# EasyEDA Pro project New Project_2023-10-24_16-38-30.eprj

# Schematic Schematic1
Create Date: 2023-10-24; Page Name: P1; Project Name: New Project_2023-10-24_16-38-30; Schematic Name: Schematic1; Update Date: 2023-10-29; Company: 嘉立创EDA; Page Size: A4; Version: V1.0
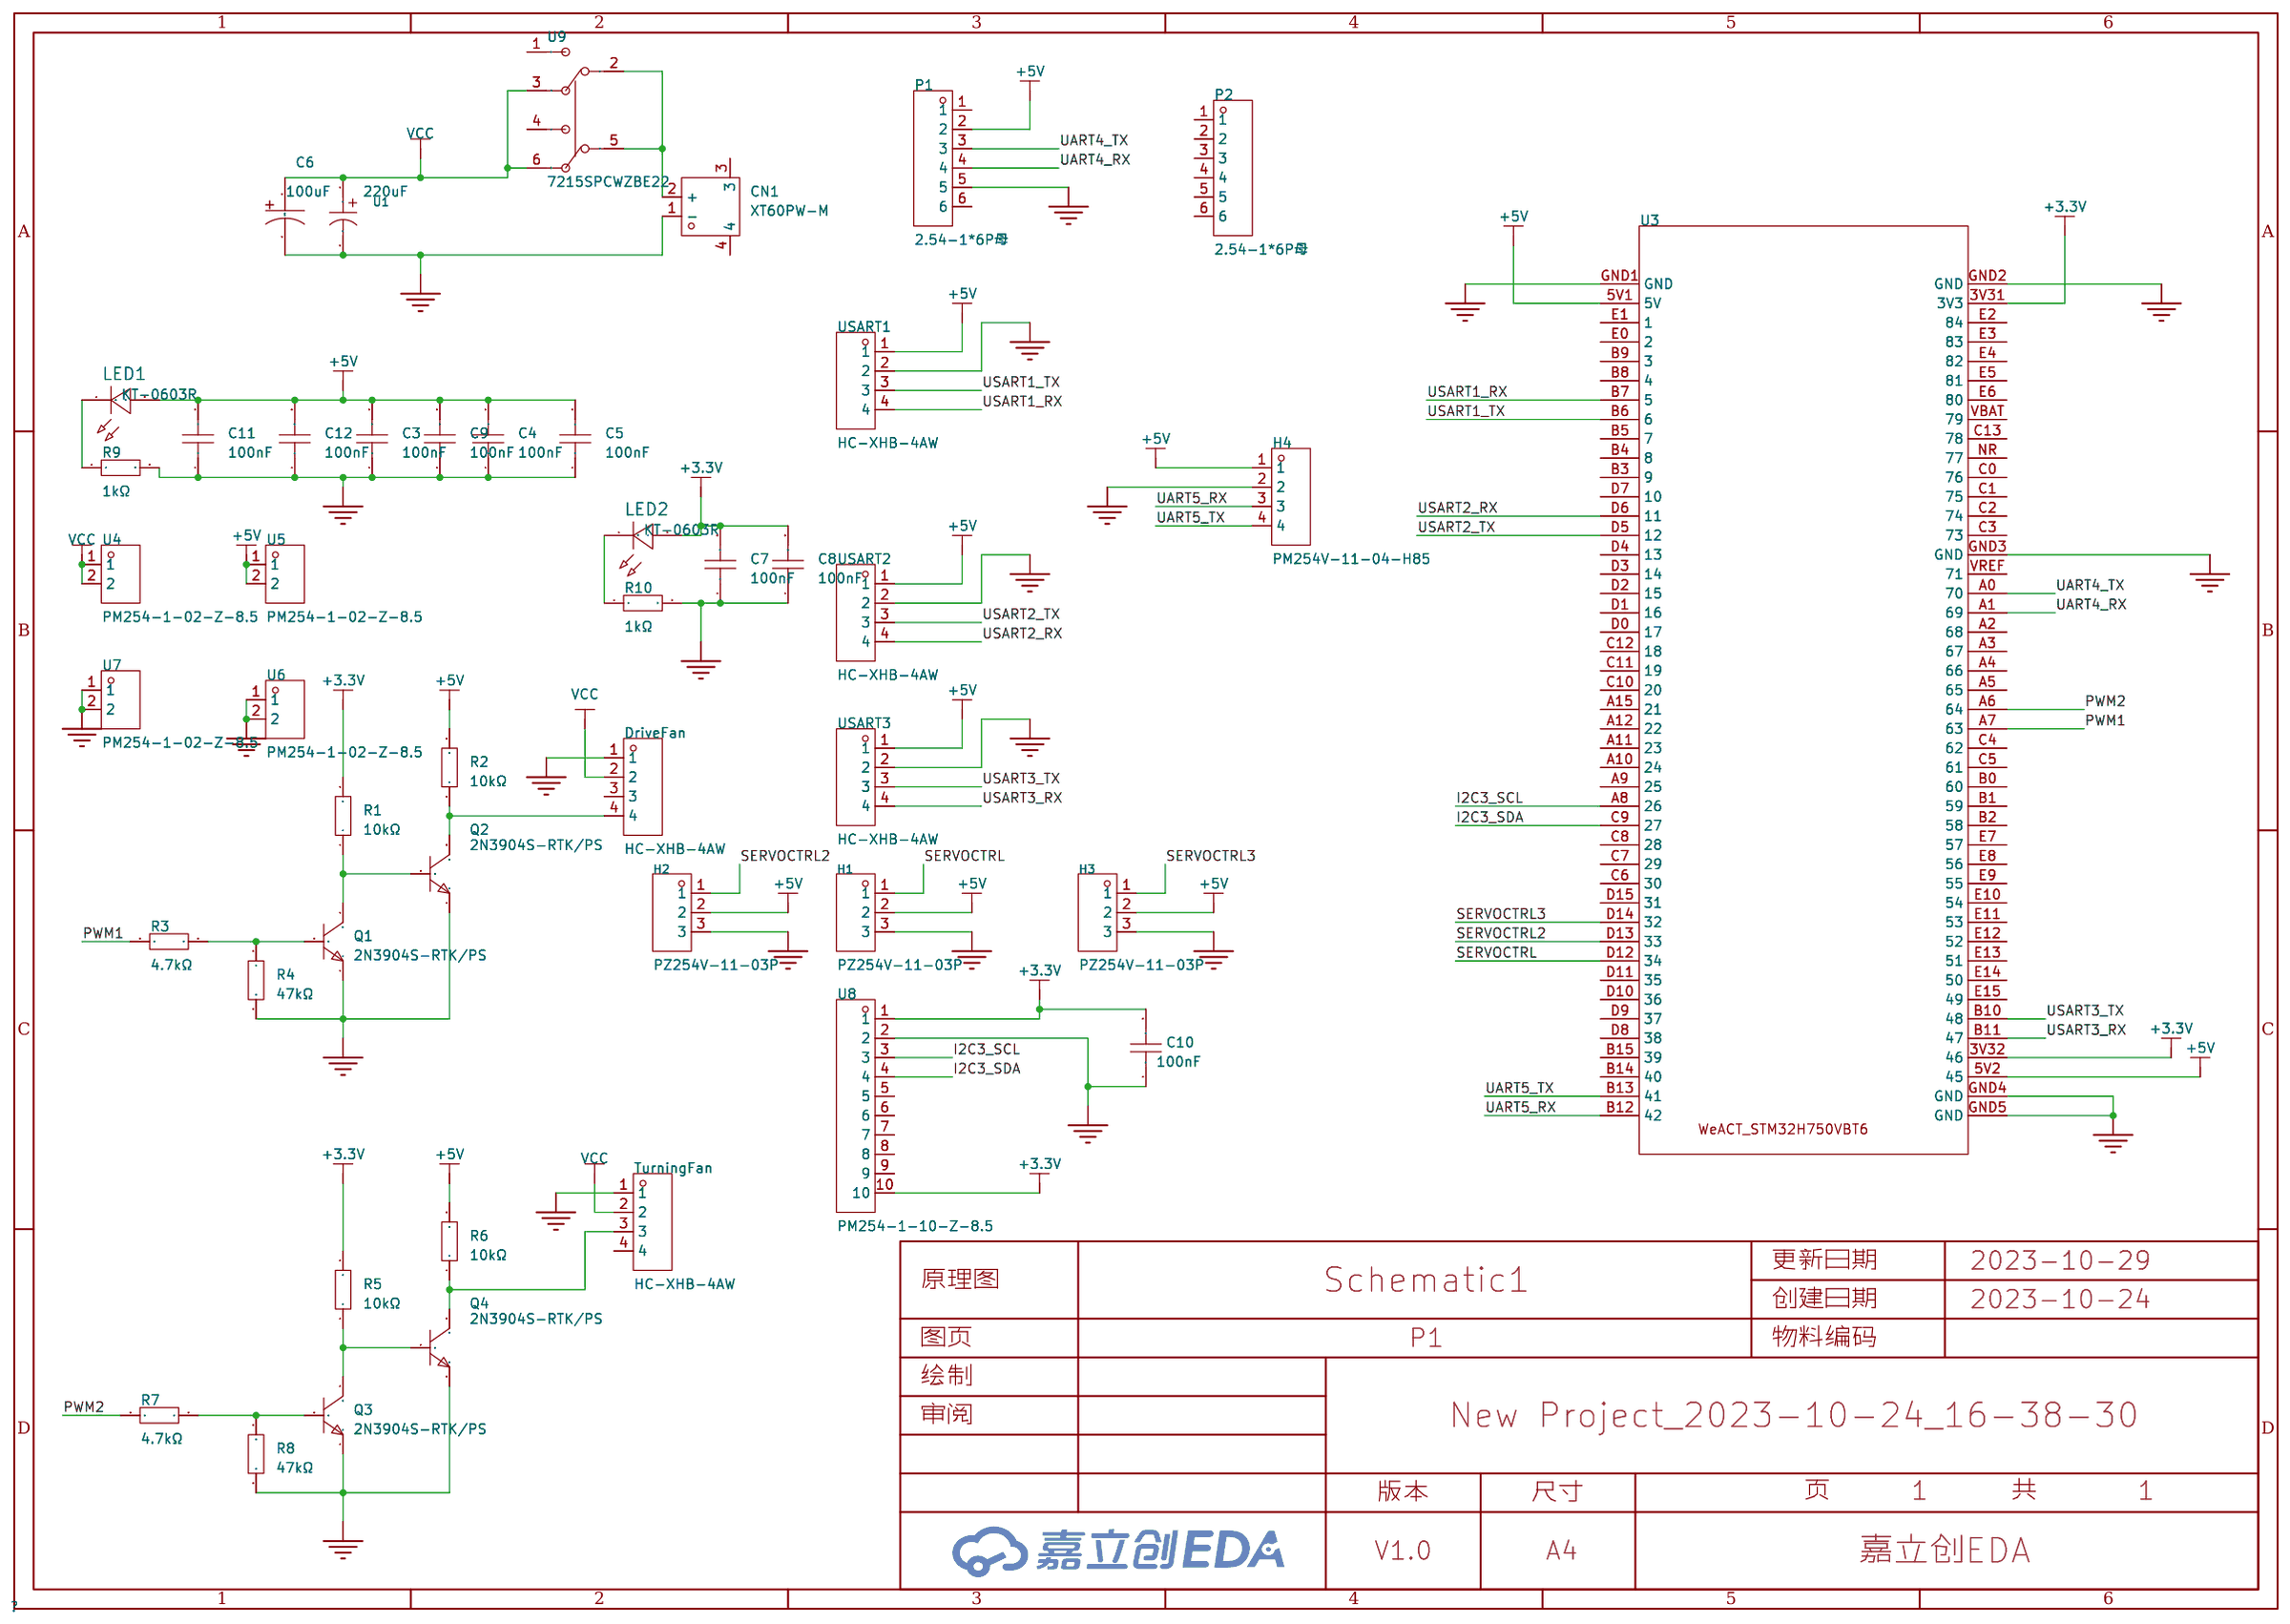
[diagram p0: schematic sheet]

## Parts
C3  100nF  [C0603]
C4  100nF  [C0603]
C5  100nF  [C0603]
C6  100uF  [CAP-SMD_BD6.3-L6.6-W6.6-RD]
C7  100nF  [C0603]
C8  100nF  [C0603]
C9  100nF  [C0603]
C10  100nF  [C0603]
C11  100nF  [C0603]
C12  100nF  [C0603]
CN1  XT60PW-M  [CONN-TH_XT60PW-M]
DriveFan  HC-XHB-4AW  [CONN-TH_4P-P2.5_HCTL_HC-XHB-4AW]
H1  PZ254V-11-03P  [HDR-TH_3P-P2.54-V-M]
H2  PZ254V-11-03P  [HDR-TH_3P-P2.54-V-M]
H3  PZ254V-11-03P  [HDR-TH_3P-P2.54-V-M]
H4  PM254V-11-04-H85  [HDR-TH_4P-P2.54-V-F]
LED1  KT-0603R  [LED0603-RD]
LED2  KT-0603R  [LED0603-RD]
P1  2.54-1*6P母  [HDR-TH_6P-P2.54-V-F]
P2  2.54-1*6P母  [HDR-TH_6P-P2.54-V-F]
Q1  2N3904S-RTK/PS  [SOT-23-3_L2.9-W1.3-P1.90-LS2.4-TR]
Q2  2N3904S-RTK/PS  [SOT-23-3_L2.9-W1.3-P1.90-LS2.4-TR]
Q3  2N3904S-RTK/PS  [SOT-23-3_L2.9-W1.3-P1.90-LS2.4-TR]
Q4  2N3904S-RTK/PS  [SOT-23-3_L2.9-W1.3-P1.90-LS2.4-TR]
R1  10kΩ  [R0603]
R2  10kΩ  [R0603]
R3  4.7kΩ  [R0603]
R4  47kΩ  [R0603]
R5  10kΩ  [R0603]
R6  10kΩ  [R0603]
R7  4.7kΩ  [R0603]
R8  47kΩ  [R0603]
R9  1kΩ  [R0603]
R10  1kΩ  [R0603]
TurningFan  HC-XHB-4AW  [CONN-TH_4P-P2.5_HCTL_HC-XHB-4AW]
U1  220uF  [CAP-SMD_BD6.3-L6.6-W6.6-LS7.2-FD]
U3  -  [WeAct_STM32H750VBT6核心板]
U4  PM254-1-02-Z-8.5  [HDR-TH_2P-P2.54-V-F]
U5  PM254-1-02-Z-8.5  [HDR-TH_2P-P2.54-V-F]
U6  PM254-1-02-Z-8.5  [HDR-TH_2P-P2.54-V-F]
U7  PM254-1-02-Z-8.5  [HDR-TH_2P-P2.54-V-F]
U8  PM254-1-10-Z-8.5  [HDR-TH_10P-P2.54-V-F]
U9  7215SPCWZBE22  [SW-TH_6P-L12.7-W11.4-P4.70-LS4.8]
USART1  HC-XHB-4AW  [CONN-TH_4P-P2.5_HCTL_HC-XHB-4AW]
USART2  HC-XHB-4AW  [CONN-TH_4P-P2.5_HCTL_HC-XHB-4AW]
USART3  HC-XHB-4AW  [CONN-TH_4P-P2.5_HCTL_HC-XHB-4AW]

## Library data of the parts
C3-C5 C7-C12 = CC0603KRX7R9BB104: 容值:100nF;精度:±10%;额定电压:50V;材质(温度系数):X7R;; LCSC Part Name: 100nF ±10% 50V; Supplier Part: C14663; Manufacturer: YAGEO(国巨); Supplier Footprint: 0603; JLCPCB Part Class: 基础库; Datasheet: https://atta.szlcsc.com/upload/public/pdf/source/20180910/C282072_33301C7F631E79921B82A8DAC6BCC5B3.pdf; Supplier: LCSC; Tolerance: ±10%; Voltage Rated: 50V; Temperature Coefficient: X7R
C6 = VZH101M1ETR-0607: 容值:100uF;精度:±20%;额定电压:25V;纹波电流:-;等效串联电阻:-;; LCSC Part Name: 100uF ±20% 25V; Supplier Part: C311617; Manufacturer: lelon(立隆); Supplier Footprint: SMD,D6.3xL7.7mm; JLCPCB Part Class: Extended Part; Datasheet: https://atta.szlcsc.com/upload/public/pdf/source/20180930/C311617_94F1283F4013E6085CC80C8D936B2FD6.pdf; Supplier: LCSC; Tolerance: ±20%; Rated Voltage: 25V; φD: 6.3mm; L: 7.7mm; Lifetime @ Temp: 2000hrs@105℃; Operating Temperature: -45℃~+105℃
CN1 = XT60PW-M: 模型锂电连接器; LCSC Part Name: AMASS(艾迈斯)航模插头xt90连接器150公母对接pw锂电池公头 板插卧式XT60PW-M; Supplier Part: C98732; Manufacturer: AMASS(艾迈斯); JLCPCB Part Class: Extended Part; Datasheet: https://atta.szlcsc.com/upload/public/pdf/source/20180125/C98732_15168617837851301983.pdf; Supplier: LCSC
DriveFan TurningFan USART1-USART3 = HC-XHB-4AW: 参考系列:-;间距:2.5mm;插针结构:1x4P;排数:1;每排PIN数:4;行距:-;公母:公型插针;安装方式:弯插;额定电流:3A;工作温度范围:-25℃~+85℃;; LCSC Part Name: 2.54带锁扣卧式插件 4P 针座连接器线对板/线对线连接器; Supplier Part: C2845507; Manufacturer: HCTL(华灿天禄); Supplier Footprint: 弯插,P=2.5mm; JLCPCB Part Class: 扩展库; Datasheet: https://atta.szlcsc.com/upload/public/pdf/source/20210729/C2845505_EFBF7AEAA36C6A5A1E79F7933436620E.pdf; Supplier: LCSC; Pitch: 2.5mm; Pins Structure: 1x4P; Number of Rows: 1; Number of PINs Per Row: 4; Gender: 公型插针; Mounting Style: 弯插; Current Rating (Max): 3A; Operating Temperature Range: -25℃~+85℃
H1-H3 = PZ254V-11-03P: 排数:单排;总PIN位数:3;间距:2.54mm;插针结构:1x3P;行距:-;安装类型:直插;圆针/方针:方针;额定电流:3A;额定电压:250V;配合针长度:6mm;塑高:2.5mm;端接针长度:3mm;工作温度范围:-40℃~+105℃;颜色:黑色;; LCSC Part Name: 2.54mm 1x3P 直插 方针; Supplier Part: C2937625; Manufacturer: XFCN(兴飞); Supplier Footprint: 直插,P=2.54mm; JLCPCB Part Class: 扩展库; Datasheet: 2022-07-12/581362A/62b9d00620994b3696be7eb4af85ad72/双排排针和单排排针.pdf; Supplier: LCSC; Number of Rows: 单排; Number of Pins: 3; Pitch: 2.54mm; Pin Structure: 1x3P; Mounting Type: 直插; Circluar Pins/Square Pins: 方针; Current Rating (Max): 3A; Voltage Rating (Max): 250V; Length of Mating Pin: 6mm; Insulation Height: 2.5mm; Length of End Connection Pin: 3mm; Operating Temperature Range: -40℃~+105℃; Color: 黑色
H4 = PM254V-11-04-H85: 排数:单排;总孔位数:4P;间距:2.54mm;插孔结构:1x4P;行距:-;安装类型:直插;塑高:-;触头材质:黄铜;触头镀层:-;; LCSC Part Name: 间距:2.54mm 1x4P 直插; Supplier Part: C541851; Manufacturer: XFCN(兴飞); Supplier Footprint: 插件,P=2.54mm; JLCPCB Part Class: 扩展库; Datasheet: https://atta.szlcsc.com/upload/public/pdf/source/20200518/C541849_85853D71FC67C51915A806977A588FDA.pdf; Supplier: LCSC; Number of Rows: 单排; Number of Holes: 4P; Pitch: 2.54mm; Holes Structure: 1x4P; Mounting Type: 直插; Contact Material: 黄铜
LED1 LED2 = KT-0603R: 发光颜色:红灯;二极管配置:-;透镜颜色:-;主波长:-;色温:-;功率:-;发光角度:-;安装方式:-;工作温度:-40℃~+85℃;; LCSC Part Name: 0603 红灯 高亮; Supplier Part: C2286; Manufacturer: KENTO; Supplier Footprint: 0603; JLCPCB Part Class: Basic Part; Datasheet: https://atta.szlcsc.com/upload/public/pdf/source/20160616/1466072038404.pdf; Supplier: LCSC; Emitted Color: 红灯; Operating Temperature: -40℃~+85℃
P1 P2 = 2.54-1*6P母: 排数:单排;总孔位数:6P;间距:2.54mm;插孔结构:1x6P;行距:-;安装类型:直插;塑高:-;触头材质:-;触头镀层:-;; LCSC Part Name: 间距:2.54mm 1x6P 直插; Supplier Part: C40877; Manufacturer: BOOMELE(博穆精密); Supplier Footprint: 插件,P=2.54mm; JLCPCB Part Class: 扩展库; Datasheet: https://atta.szlcsc.com/upload/public/pdf/source/20210301/C2718488_F4427B881E42CAA8DDB0B1C12B3A522C.pdf; Supplier: LCSC; Number of Rows: 单排; Number of Holes: 6P; Pitch: 2.54mm; Holes Structure: 1x6P; Mounting Type: 直插
Q1-Q4 = 2N3904S-RTK/PS: 晶体管类型:NPN;集射极击穿电压(Vceo):40V;集电极电流(Ic):200mA;功率(Pd):350mW;直流电流增益(hFE@Ic,Vce):100@10mA,1V;; LCSC Part Name: NPN 40V 200mA; Supplier Part: C18536; Manufacturer: KEC; Supplier Footprint: SOT-23; JLCPCB Part Class: 扩展库; Datasheet: https://atta.szlcsc.com/upload/public/pdf/source/20160416/1460799387204.pdf; Supplier: LCSC; Transistor Type: NPN; Collector-Emitter Breakdown Voltage (Vceo): 40V; Collector Current (Ic): 200mA; Power Dissipation (Pd): 350mW; Collector-Emitter Saturation Voltage (VCE(sat)@Ic,Ib): 300mV@50mA,5mA; DC Current Gain (hFE@Ic,Vce): 100@10mA,1V; Transition Frequency (fT): 300MHz; Operating Temperature: +150℃@(Tj)
R1 R2 R5 R6 = 0603WAF1002T5E: 电阻类型:厚膜电阻;阻值:10kΩ;精度:±1%;功率:100mW;; LCSC Part Name: 厚膜电阻 10kΩ ±1% 100mW; Supplier Part: C25804; Manufacturer: UNI-ROYAL(厚声); Supplier Footprint: 0603; JLCPCB Part Class: Basic Part; Datasheet: https://atta.szlcsc.com/upload/public/pdf/source/20200306/C422600_1E6D84923E4A46A82E41ADD87F860B5C.pdf; Supplier: LCSC; Type: 厚膜电阻; Tolerance: ±1%; Power(Watts): 100mW; Temperature Coefficient: ±100ppm/℃; Overload Voltage (Max): 75V; Operating Temperature Range: -55℃~+155℃
R3 R7 = 0603WAF4701T5E: 电阻类型:厚膜电阻;阻值:4.7kΩ;精度:±1%;功率:100mW;; LCSC Part Name: 4.7kΩ ±1% 100mW; Supplier Part: C23162; Manufacturer: UNI-ROYAL(厚声); Supplier Footprint: 0603; JLCPCB Part Class: Basic Part; Datasheet: https://atta.szlcsc.com/upload/public/pdf/source/20200306/C422600_1E6D84923E4A46A82E41ADD87F860B5C.pdf; Supplier: LCSC; Type: 厚膜电阻; Tolerance: ±1%; Power(Watts): 100mW; Temperature Coefficient: ±100ppm/℃; Overload Voltage (Max): 75V; Operating Temperature Range: -55℃~+155℃
R4 R8 = 0603WAF4702T5E: 电阻类型:厚膜电阻;阻值:47kΩ;精度:±1%;功率:100mW;; LCSC Part Name: 47kΩ ±1% 100mW; Supplier Part: C25819; Manufacturer: UNI-ROYAL(厚声); Supplier Footprint: 0603; JLCPCB Part Class: Basic Part; Datasheet: https://atta.szlcsc.com/upload/public/pdf/source/20200306/C422600_1E6D84923E4A46A82E41ADD87F860B5C.pdf; Supplier: LCSC; Type: 厚膜电阻; Tolerance: ±1%; Power(Watts): 100mW; Temperature Coefficient: ±100ppm/℃; Overload Voltage (Max): 75V; Operating Temperature Range: -55℃~+155℃
R9 R10 = 0603WAF1001T5E: 电阻类型:厚膜电阻;阻值:1kΩ;精度:±1%;功率:100mW;温度系数:±100ppm/℃;; LCSC Part Name: 厚膜电阻 1kΩ ±1% 100mW; Supplier Part: C21190; Manufacturer: UNI-ROYAL(厚声); Supplier Footprint: 0603; JLCPCB Part Class: Basic Part; Datasheet: https://atta.szlcsc.com/upload/public/pdf/source/20200306/C422600_1E6D84923E4A46A82E41ADD87F860B5C.pdf; Supplier: LCSC; Type: 厚膜电阻; Tolerance: ±1%; Power(Watts): 100mW; Temperature Coefficient: ±100ppm/℃; Overload Voltage (Max): 75V; Operating Temperature Range: -55℃~+155℃
U1 = RST220UF25V019: 容值:220uF;精度:±20%;额定电压:25V;纹波电流:165mA@120Hz;等效串联电阻:-;; LCSC Part Name: 220uF ±20% 25V; Supplier Part: C4747974; Manufacturer: KNSCHA(科尼盛); Supplier Footprint: SMD,D6.3xL7.7mm; JLCPCB Part Class: Extended Part; Datasheet: https://atta.szlcsc.com/upload/public/pdf/source/20220722/2E7F51AC9BE193B364DA1207D7353D66.pdf; Supplier: LCSC; Tolerance: ±20%; Rated Voltage: 25V; φD: 6.3mm; L: 7.7mm; Ripple Current: 165mA@120Hz; Lifetime @ Temp: 2000hrs@105℃; Operating Temperature: -55℃~+105℃
U3 = STM32H750VBT6: Check: false
U4-U7 = PM254-1-02-Z-8.5: 排数:单排;总孔位数:2P;间距:2.54mm;插孔结构:1x2P;行距:-;安装类型:直插;圆孔/方孔:方孔;额定电流:3A;额定电压:-;插孔方向:顶部;塑高:8.5mm;工作温度范围:-40℃~+105℃;; LCSC Part Name: 间距:2.54mm 1x2P 直插; Supplier Part: C2897365; Manufacturer: HCTL(华灿天禄); Supplier Footprint: 插件,P=2.54mm; JLCPCB Part Class: 扩展库; Datasheet: https://atta.szlcsc.com/upload/public/pdf/source/20230609/534BE42964C679BDE98E061007C4ABD6.pdf; Supplier: LCSC; Number of Rows: 单排; Number of Holes: 2P; Pitch: 2.54mm; Holes Structure: 1x2P; Mounting Type: 直插; Circular Hole / Square Hole: 方孔; Current Rating (Max): 3A; Holes Direction: 顶部; Insulation Height: 8.5mm; Operating Temperature Range: -40℃~+105℃
U8 = PM254-1-10-Z-8.5: 排数:单排;总孔位数:10P;间距:2.54mm;插孔结构:1x10P;行距:-;安装类型:直插;圆孔/方孔:方孔;额定电流:3A;额定电压:-;插孔方向:顶部;塑高:8.5mm;工作温度范围:-40℃~+105℃;; LCSC Part Name: 间距:2.54mm 1x10P 直插; Supplier Part: C2897373; Manufacturer: HCTL(华灿天禄); Supplier Footprint: 插件,P=2.54mm; JLCPCB Part Class: Extended Part; Datasheet: https://atta.szlcsc.com/upload/public/pdf/source/20230609/534BE42964C679BDE98E061007C4ABD6.pdf; Supplier: LCSC; Number of Rows: 单排; Number of Holes: 10P; Pitch: 2.54mm; Holes Structure: 1x10P; Mounting Type: 直插; Circular Hole / Square Hole: 方孔; Current Rating (Max): 3A; Holes Direction: 顶部; Insulation Height: 8.5mm; Operating Temperature Range: -40℃~+105℃
U9 = 7215SPCWZBE22: LCSC Part Name: 钮子开关; Supplier Part: C2895583; Manufacturer: C&amp;K; Supplier Footprint: 插件; JLCPCB Part Class: 扩展库; Datasheet: https://atta.szlcsc.com/upload/public/pdf/source/20211231/11C8489155551633DA4BD4318A5AC87F.pdf; Supplier: LCSC

## Nets
+3.3V: C7.2 C8.2 C10.2 LED2.2(A) R1.2 R5.2 U3.3V31(3V3) U3.3V32(46) U8.1 U8.10
+5V: C3.2 C4.2 C5.2 C9.2 C11.2 C12.2 H1.2 H2.2 H3.2 H4.1 LED1.2(A) P1.2 R2.2 R6.2 U3.5V1(5V) U3.5V2(45) U5.1 U5.2 USART1.1 USART2.1 USART3.1
GND: C3.1 C4.1 C5.1 C6.2 C7.1 C8.1 C9.1 C10.1 C11.1 C12.1 CN1.1(-) DriveFan.1 H1.3 H2.3 H3.3 H4.2 P1.5 Q1.1(E) Q2.1(E) Q3.1(E) Q4.1(E) R4.2 R8.2 R9.2 R10.2 TurningFan.1 U1.2 U3.GND1(GND) U3.GND2(GND) U3.GND3(GND) U3.GND4(GND) U3.GND5(GND) U6.1 U6.2 U7.1 U7.2 U8.2 USART1.2 USART2.2 USART3.2
VCC: C6.1 DriveFan.2 TurningFan.2 U1.1 U4.1 U4.2 U9.3 U9.6
I2C3_SCL: U3.A8(26) U8.3
I2C3_SDA: U3.C9(27) U8.4
PWM1: R3.2 U3.A7(63)
PWM2: R7.2 U3.A6(64)
SERVOCTRL: H1.1 U3.D12(34)
SERVOCTRL2: H2.1 U3.D13(33)
SERVOCTRL3: H3.1 U3.D14(32)
UART4_RX: P1.4 U3.A1(69)
UART4_TX: P1.3 U3.A0(70)
UART5_RX: H4.3 U3.B12(42)
UART5_TX: H4.4 U3.B13(41)
USART1_RX: U3.B7(5) USART1.4
USART1_TX: U3.B6(6) USART1.3
USART2_RX: U3.D6(11) USART2.4
USART2_TX: U3.D5(12) USART2.3
USART3_RX: U3.B11(47) USART3.4
USART3_TX: U3.B10(48) USART3.3
$1N689: Q1.2(B) R3.1 R4.1
$1N701: Q1.3(C) Q2.2(B) R1.1
$1N976: Q3.3(C) Q4.2(B) R5.1
$1N993: DriveFan.4 Q2.3(C) R2.1
$1N1002: Q4.3(C) R6.1 TurningFan.3
$1N1022: Q3.2(B) R7.1 R8.1
$1N3852: LED1.1(C) R9.1
$1N4179: LED2.1(C) R10.1
$1N8727: CN1.2(+) U9.2 U9.5

Not connected (* = marked no-connect by the designer): CN1 3 4; DriveFan 3; P1 1 6; P2 1 2 3 4 5 6; TurningFan 4; U3 A2(68) A3(67) A4(66) A5(65) A9(25) A10(24) A11(23) A12(22) A15(21) B0(60) B1(59) B2(58) B3(9) B4(8) B5(7) B8(4) B9(3) B14(40) B15(39) C0(76) C1(75) C2(74) C3(73) C4(62) C5(61) C6(30) C7(29) C8(28) C10(20) C11(19) C12(18) C13(78) D0(17) D1(16) D2(15) D3(14) D4(13) D7(10) D8(38) D9(37) D10(36) D11(35) D15(31) E0(2) E1(1) E2(84) E3(83) E4(82) E5(81) E6(80) E7(57) E8(56) E9(55) E10(54) E11(53) E12(52) E13(51) E14(50) E15(49) NR(77) VBAT(79) VREF(71); U8 5 6 7 8 9; U9 1 4

# Board PCB1
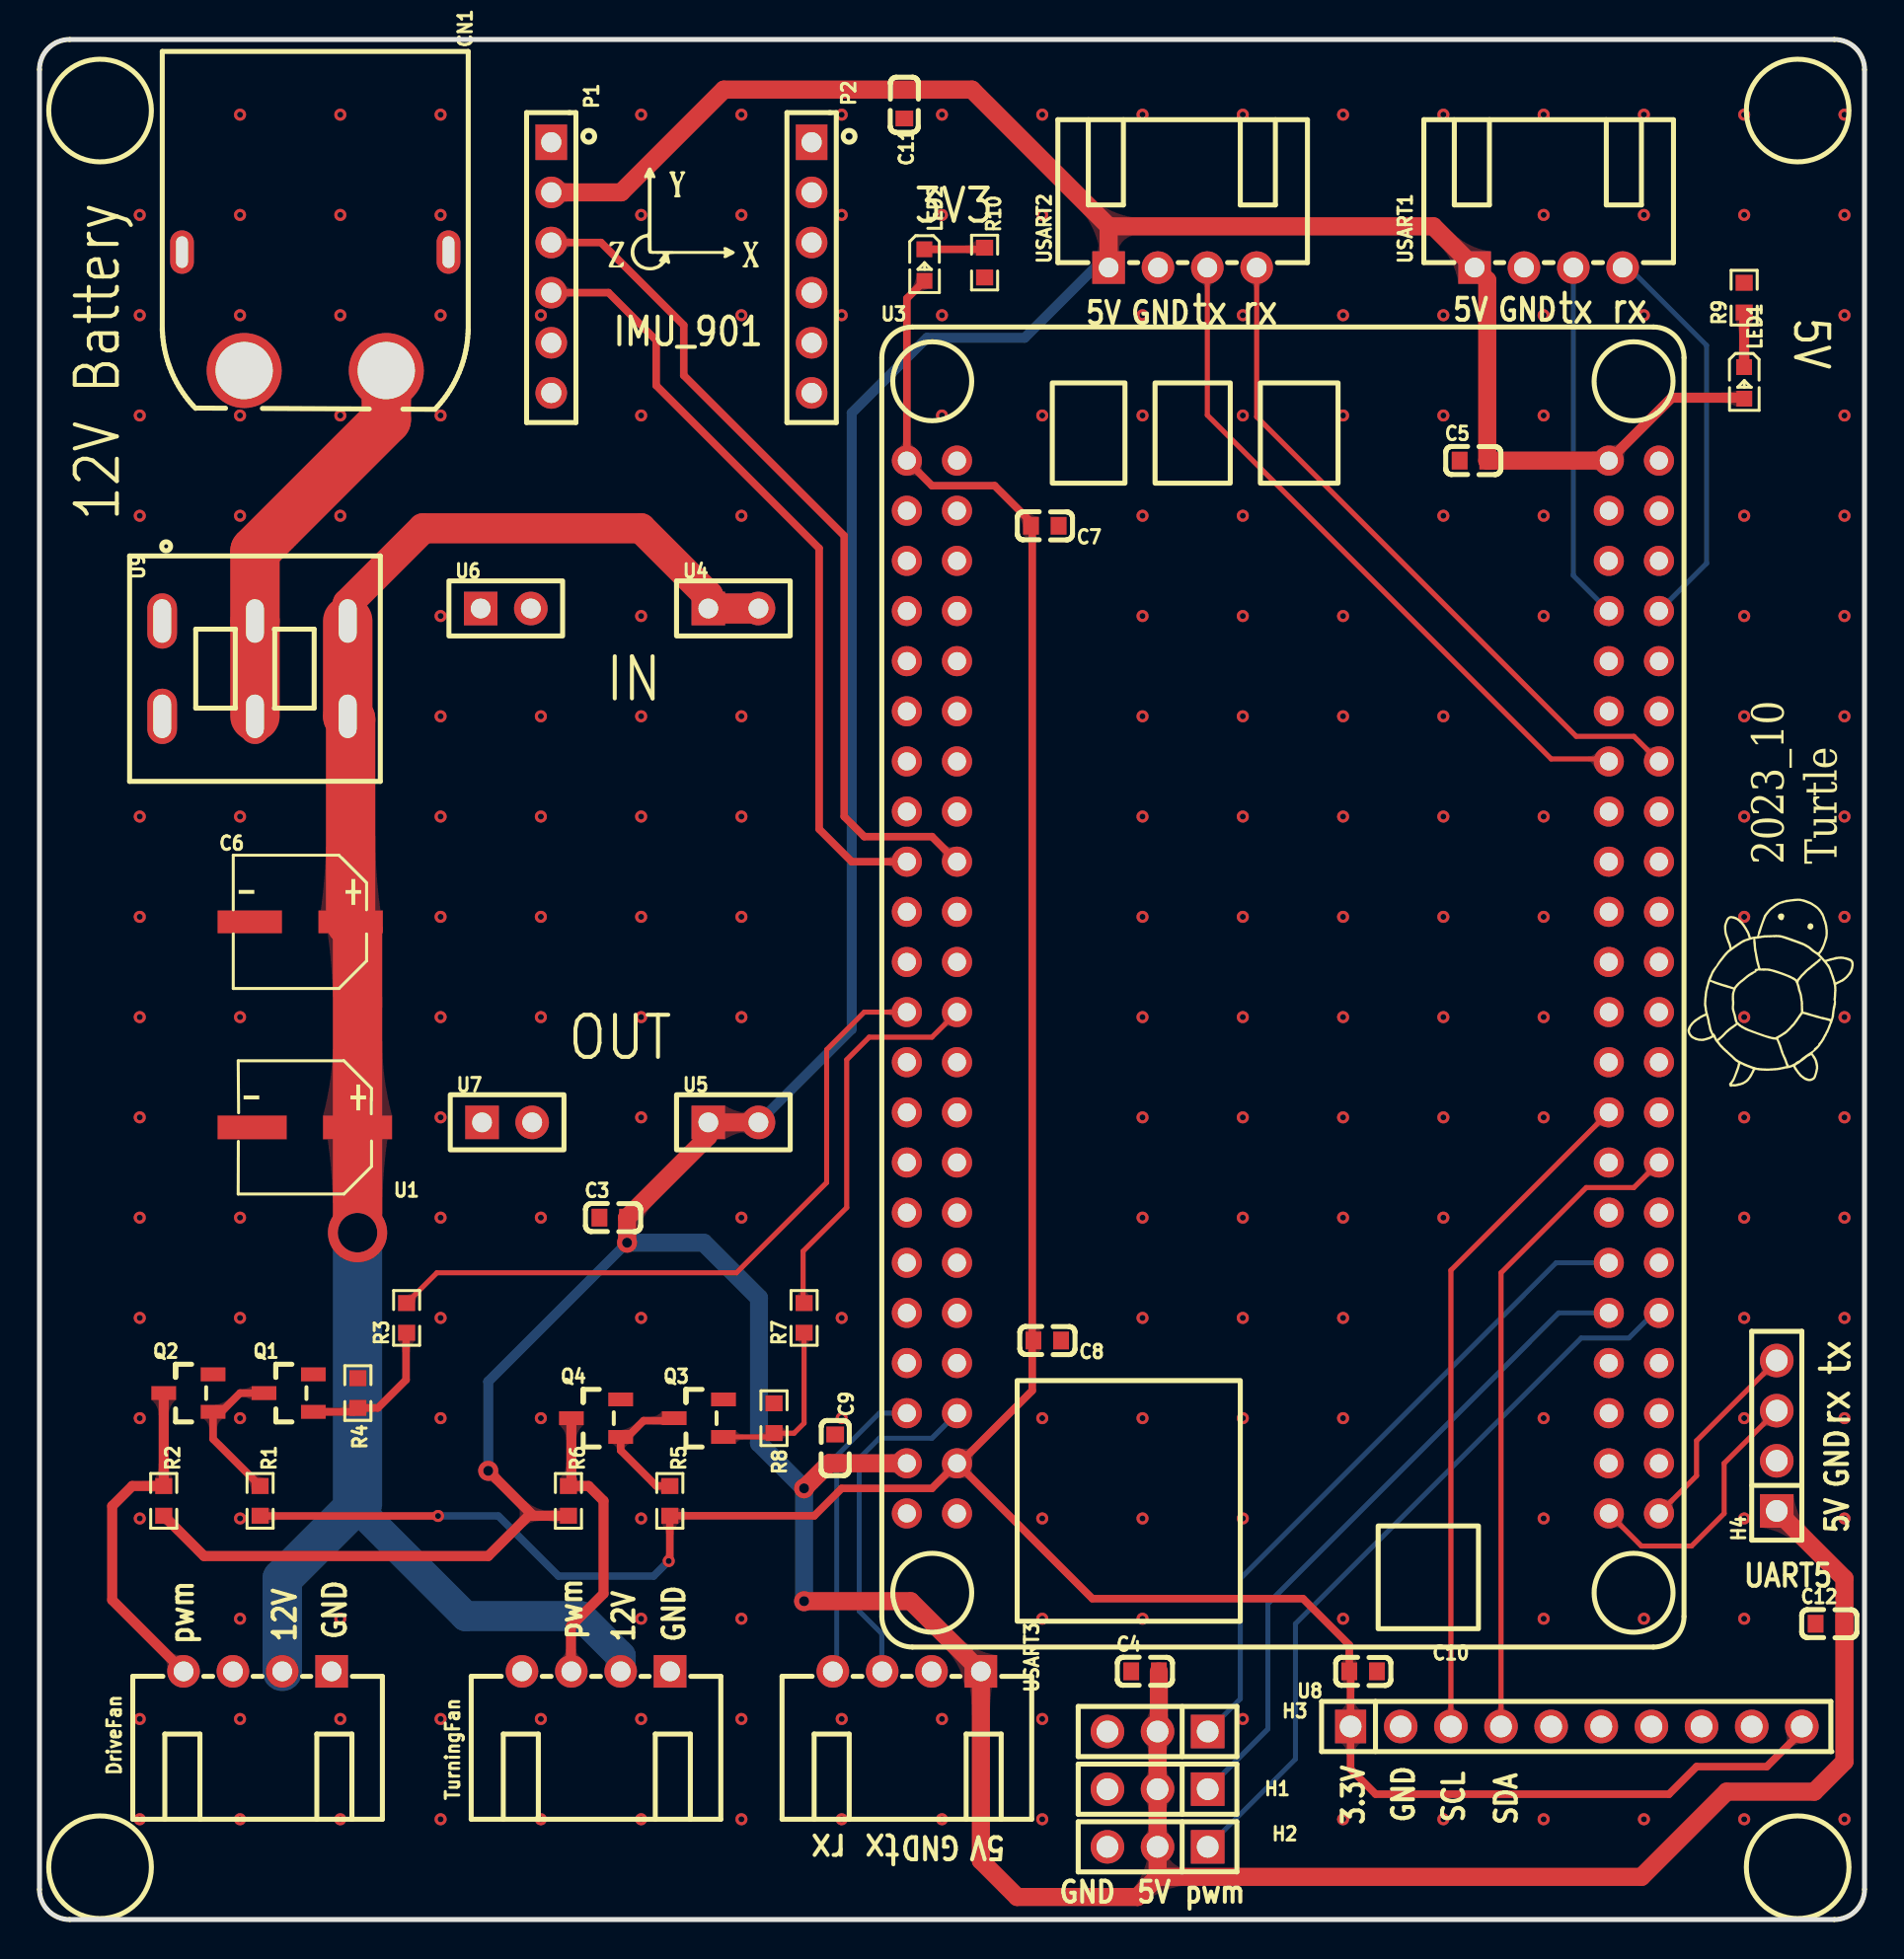
[diagram p1: board, top side]
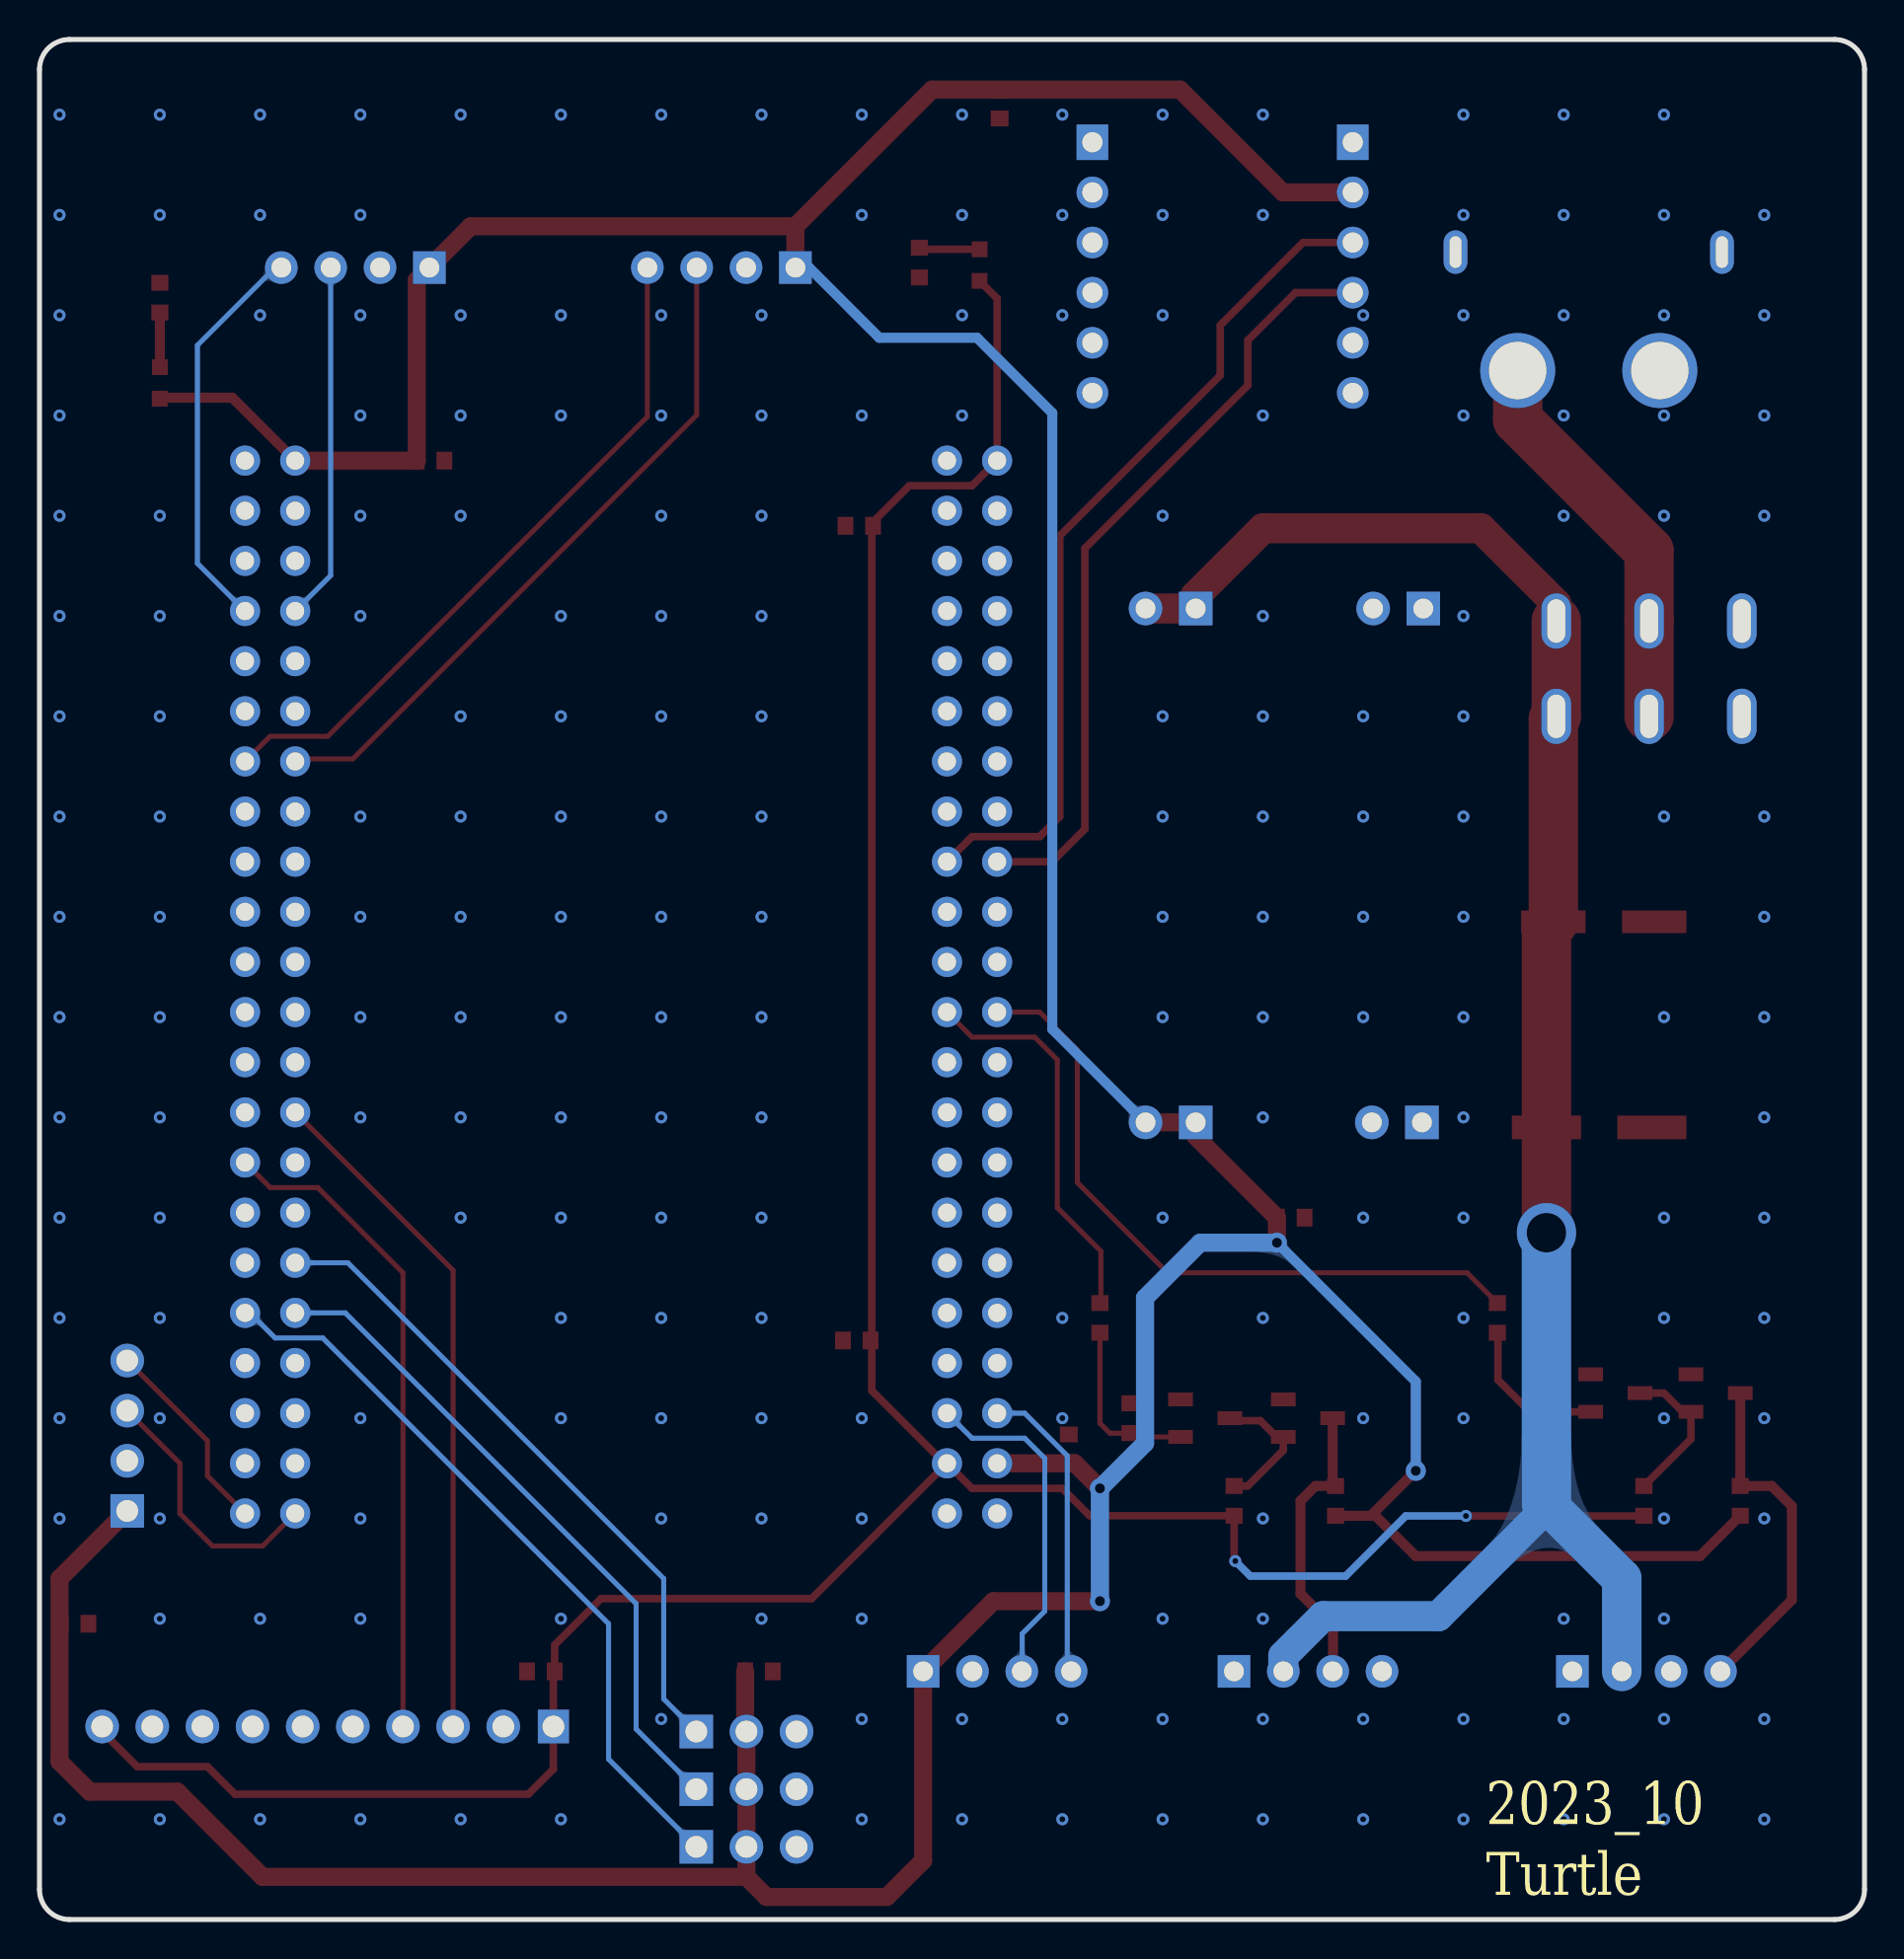
[diagram p2: board, bottom side, seen from below]

Outline 92.46 x 95.25 mm; copper layers: Top Layer, Bottom Layer. Coordinates in mm from the lower left corner of the outline.
Outline path: 0,93.73 0,1.52 arc(0.45,0.45) 1.52,0 90.93,0 arc(92.01,0.45) 92.46,1.52 92.46,93.73 arc(92.01,94.8) 90.93,95.25 1.52,95.25 arc(0.45,94.8) 0,93.73
Stack: Top Layer 0.035mm / Dielectric1 1.51mm FR4 er 4.5 / Bottom Layer 0.035mm

## Design rules (mm)
template: 自定义配置
spacing copperThickness1oz (default): track to track 0.102, other pairs 0.152 to 0.3
spacing copperThickness2oz: track to track 0.203, other pairs 0.152 to 0.3
track width copperThickness1oz (default): min 0.127, default 0.254, max 2.54
track width copperThickness2oz: min 0.203, default 0.254, max 2.54
differential pair differentialPair (default): width min 0.127, default 0.254, max 2.54; gap min 0.152, default 0.152
via viaSize (default): diameter min 0.5, default 0.61, max 10; hole min 0.3, default 0.305, max 6.3

## Placement (name value [footprint] x y rotation side)
C3  100nF  [C0603]  29.07 35.56 0 top
C4  100nF  [C0603]  56.01 12.57 0 top
C5  100nF  [C0603]  72.64 73.91 0 top
C6  100uF  [CAP-SMD_BD6.3-L6.6-W6.6-RD]  13.21 50.55 0 top
C7  100nF  [C0603]  50.93 70.61 180 top
C8  100nF  [C0603]  51.05 29.34 180 top
C9  100nF  [C0603]  40.31 23.88 270 top
C10  100nF  [C0603]  67.06 12.57 180 top
C11  100nF  [C0603]  43.82 91.95 90 top
C12  100nF  [C0603]  90.68 14.99 0 top
CN1  XT60PW-M  [CONN-TH_XT60PW-M]  13.97 81.48 270 top
DriveFan  HC-XHB-4AW  [CONN-TH_4P-P2.5_HCTL_HC-XHB-4AW]  11.05 12.57 0 top
H1  PZ254V-11-03P  [HDR-TH_3P-P2.54-V-M]  56.64 6.6 180 top
H2  PZ254V-11-03P  [HDR-TH_3P-P2.54-V-M]  56.64 3.68 180 top
H3  PZ254V-11-03P  [HDR-TH_3P-P2.54-V-M]  56.64 9.53 180 top
H4  PM254V-11-04-H85  [HDR-TH_4P-P2.54-V-F]  88.01 24.51 90 top
LED1  KT-0603R  [LED0603-RD]  86.36 77.85 270 top
LED2  KT-0603R  [LED0603-RD]  44.83 83.82 270 top
P1  2.54-1*6P母  [HDR-TH_6P-P2.54-V-F]  25.93 83.69 270 top
P2  2.54-1*6P母  [HDR-TH_6P-P2.54-V-F]  39.12 83.69 270 top
Q1  2N3904S-RTK/PS  [SOT-23-3_L2.9-W1.3-P1.90-LS2.4-TR]  12.62 26.67 0 top
Q2  2N3904S-RTK/PS  [SOT-23-3_L2.9-W1.3-P1.90-LS2.4-TR]  7.54 26.67 0 top
Q3  2N3904S-RTK/PS  [SOT-23-3_L2.9-W1.3-P1.90-LS2.4-TR]  33.4 25.4 0 top
Q4  2N3904S-RTK/PS  [SOT-23-3_L2.9-W1.3-P1.90-LS2.4-TR]  28.19 25.4 0 top
R1  10kΩ  [R0603]  11.18 21.21 270 top
R2  10kΩ  [R0603]  6.29 21.21 270 top
R3  4.7kΩ  [R0603]  18.6 30.48 90 top
R4  47kΩ  [R0603]  16.13 26.67 90 top
R5  10kΩ  [R0603]  31.93 21.21 270 top
R6  10kΩ  [R0603]  26.8 21.21 270 top
R7  4.7kΩ  [R0603]  38.73 30.48 90 top
R8  47kΩ  [R0603]  37.21 25.4 90 top
R9  1kΩ  [R0603]  86.36 82.17 90 top
R10  1kΩ  [R0603]  47.88 83.95 270 top
TurningFan  HC-XHB-4AW  [CONN-TH_4P-P2.5_HCTL_HC-XHB-4AW]  28.19 12.57 0 top
U1  220uF  [CAP-SMD_BD6.3-L6.6-W6.6-LS7.2-FD]  13.44 40.13 180 top
U3  -  [WeAct_STM32H750VBT6核心板]  62.99 47.24 0 top
U4  PM254-1-02-Z-8.5  [HDR-TH_2P-P2.54-V-F]  35.15 66.42 0 top
U5  PM254-1-02-Z-8.5  [HDR-TH_2P-P2.54-V-F]  35.15 40.39 0 top
U6  PM254-1-02-Z-8.5  [HDR-TH_2P-P2.54-V-F]  23.62 66.42 0 top
U7  PM254-1-02-Z-8.5  [HDR-TH_2P-P2.54-V-F]  23.69 40.39 0 top
U8  PM254-1-10-Z-8.5  [HDR-TH_10P-P2.54-V-F]  77.85 9.78 0 top
U9  7215SPCWZBE22  [SW-TH_6P-L12.7-W11.4-P4.70-LS4.8]  10.92 63.37 270 top
USART1  HC-XHB-4AW  [CONN-TH_4P-P2.5_HCTL_HC-XHB-4AW]  76.45 83.69 180 top
USART2  HC-XHB-4AW  [CONN-TH_4P-P2.5_HCTL_HC-XHB-4AW]  57.91 83.69 180 top
USART3  HC-XHB-4AW  [CONN-TH_4P-P2.5_HCTL_HC-XHB-4AW]  43.94 12.57 0 top

## Footprints (pads in the part's own frame, mm; a bottom-side part is the same pattern mirrored in y, then rotated)
C0603
  rect 0.8x0.9 smd: 1(-0.7,0) 2(0.7,0)
CAP-SMD_BD6.3-L6.6-W6.6-LS7.2-FD
  rect 3.5x1.2 smd: 1(-2.67,0) 2(2.67,0)
CAP-SMD_BD6.3-L6.6-W6.6-RD
  rect 3.26x1.15 smd: 1(2.555,0) 2(-2.555,0)
CONN-TH_4P-P2.5_HCTL_HC-XHB-4AW
  rect 1.65x1.65 hole 1: 1(3.75,0)
  round 1.65 hole 1: 2(1.25,0) 3(-1.25,0) 4(-3.75,0)
CONN-TH_XT60PW-M
  round 3.8 hole 2.9: 1(3,-3.6) 2(3,3.6)
  oval 2.2x1.2 hole 1.6x0.6: 3(-3,6.75) 4(-3,-6.75)
HDR-TH_2P-P2.54-V-F
  rect 1.7x1.7 hole 1: 1(-1.27,0)
  round 1.7 hole 1: 2(1.27,0)
HDR-TH_3P-P2.54-V-M
  rect 1.7x1.7 hole 1.1: 1(-2.54,0)
  round 1.7 hole 1.1: 2(0,0) 3(2.54,0)
HDR-TH_4P-P2.54-V-F
  rect 1.7x1.7 hole 1.1: 1(-3.81,0)
  round 1.7 hole 1.1: 2(-1.27,0) 3(1.27,0) 4(3.81,0)
HDR-TH_6P-P2.54-V-F
  rect 1.8x1.6 hole 1.02: 1(-6.35,0)
  round 1.6 hole 1.02: 2(-3.81,0) 3(-1.27,0) 4(1.27,0) 5(3.81,0) 6(6.35,0)
HDR-TH_10P-P2.54-V-F
  rect 1.575x1.7 hole 1.1: 1(-11.43,0)
  round 1.7 hole 1.1: 2(-8.89,0) 3(-6.35,0) 4(-3.81,0) 5(-1.27,0) 6(1.27,0) 7(3.81,0) 8(6.35,0) 9(8.89,0) 10(11.43,0)
LED0603-RD
  rect 0.8x0.8 smd: 1(-0.799,-0.004) 2(0.799,0.004)
R0603
  rect 0.806x0.864 smd: 1(-0.753,0) 2(0.753,0)
SOT-23-3_L2.9-W1.3-P1.90-LS2.4-TR
  rect 1.25x0.7 smd: 1(1.25,0.95) 2(1.25,-0.95) 3(-1.25,0)
SW-TH_6P-L12.7-W11.4-P4.70-LS4.8
  oval 2.8x1.5 hole 2.2x0.9: 1(-2.415,-4.7) 2(-2.415,0) 3(-2.415,4.7) 4(2.415,-4.7) 5(2.415,0) 6(2.415,4.7)
WeAct_STM32H750VBT6核心板
  round 1.524 hole 0.914: 3V31(-19.05,26.67) 3V32(-16.51,-24.13) 5V1(16.51,26.67) 5V2(-19.05,-24.13) A0(-16.51,6.35) A1(-19.05,6.35) A2(-16.51,3.81) A3(-19.05,3.81) A4(-16.51,1.27) A5(-19.05,1.27) A6(-16.51,-1.27) A7(-19.05,-1.27) A8(16.51,-6.35) A9(19.05,-6.35) A10(16.51,-3.81) A11(19.05,-3.81) A12(16.51,-1.27) A15(19.05,-1.27) B0(-16.51,-6.35) B1(-19.05,-6.35) B2(-16.51,-8.89) B3(19.05,13.97) B4(16.51,16.51) B5(19.05,16.51) B6(16.51,19.05) B7(19.05,19.05) B8(16.51,21.59) B9(19.05,21.59) B10(-16.51,-21.59) B11(-19.05,-21.59) B12(16.51,-26.67) B13(19.05,-26.67) B14(16.51,-24.13) B15(19.05,-24.13) C0(-16.51,13.97) C1(-19.05,13.97) C2(-16.51,11.43) C3(-19.05,11.43) C4(-16.51,-3.81) C5(-19.05,-3.81) C6(16.51,-11.43) C7(19.05,-11.43) C8(16.51,-8.89) C9(19.05,-8.89) C10(16.51,1.27) C11(19.05,1.27) C12(16.51,3.81) C13(-16.51,16.51) D0(19.05,3.81) D1(16.51,6.35) D2(19.05,6.35) D3(16.51,8.89) D4(19.05,8.89) D5(16.51,11.43) D6(19.05,11.43) D7(16.51,13.97) D8(16.51,-21.59) D9(19.05,-21.59) D10(16.51,-19.05) D11(19.05,-19.05) D12(16.51,-16.51) D13(19.05,-16.51) D14(16.51,-13.97) D15(19.05,-13.97) E0(16.51,24.13) E1(19.05,24.13) E2(-16.51,24.13) E3(-19.05,24.13) E4(-16.51,21.59) E5(-19.05,21.59) E6(-16.51,19.05) E7(-19.05,-8.89) E8(-16.51,-11.43) E9(-19.05,-11.43) E10(-16.51,-13.97) E11(-19.05,-13.97) E12(-16.51,-16.51) E13(-19.05,-16.51) E14(-16.51,-19.05) E15(-19.05,-19.05) GND1(19.05,26.67) GND2(-16.51,26.67) GND3(-16.51,8.89) GND4(-19.05,-26.67) GND5(-16.51,-26.67) NR(-19.05,16.51) VBAT(-19.05,19.05) VREF(-19.05,8.89)

## Nets
As in the schematic.

Pads without a net: CN1 3 4; DriveFan 3; P1 1 6; P2 1 2 3 4 5 6; TurningFan 4; U3 A2 A3 A4 A5 A9 A10 A11 A12 A15 B0 B1 B2 B3 B4 B5 B8 B9 B14 B15 C0 C1 C2 C3 C4 C5 C6 C7 C8 C10 C11 C12 C13 D0 D1 D2 D3 D4 D7 D8 D9 D10 D11 D15 E0 E1 E2 E3 E4 E5 E6 E7 E8 E9 E10 E11 E12 E13 E14 E15 NR VBAT VREF; U8 5 6 7 8 9; U9 1 4

## Via types
v1: diameter 0.61, hole 0.305, Top Layer to Bottom Layer, 214 vias
v2: diameter 3, hole 2, Top Layer to Bottom Layer, 1 via
v3: diameter 1.016, hole 0.508, Top Layer to Bottom Layer, 4 vias

## Routing (per net, layer and track width the routed paths; a pad name or vN(x,y) marks a point on that pad's centre or on a via; arc(x,y) is an arc through that point)
+3.3V: length 161.6
  Top Layer w0.381: LED2.2 43.94,82.13 U3.3V31 45.21,72.64 48.39,72.64 50.29,70.74 50.29,26.8 46.61,23.11 U3.3V32 ; U8.10 89.28,9.53 87.5,7.75 83.95,7.75 82.55,6.35 67.69,6.35 66.42,7.62 U8.1 66.42,12.51 C10.2 66.36,13.91 64.01,16.26 53.34,16.26 U3.3V32 ; U3.3V32 45.21,21.84 40.64,21.84 39.25,20.46 R5.2 31.93,18.22 v1(31.88,18.16) ; v1(20.19,20.45) 11.19,20.45 R1.2
  Bottom Layer w0.381: v1(31.88,18.16) 31.11,17.4 26.29,17.4 23.24,20.45 v1(20.19,20.45)
+5V: length 305.1
  Top Layer w0.508: U3.5V1 82.69,77.1 86.36,77.1 ; v3(22.73,22.73) 25.01,20.46 ; 25.01,20.46 R6.2 ; 25.01,20.46 24.77,20.46 22.73,18.41 8.34,18.41 R2.2
  Top Layer w0.914: 88.01,20.7 91.44,17.27 91.44,8 89.92,6.48 85.47,6.48 81.15,2.16 56.64,2.16 ; 56.64,2.16 55.63,1.14 49.53,1.14 47.69,2.98 USART3.1 44.14,16.13 v3(38.73,16.13) ; 56.64,2.16 H2.2 H1.2 H3.2 56.71,9.59 C4.2 ; USART2.1 54.16,85.79 ; 54.16,85.79 70.61,85.79 USART1.1 73.34,83.05 73.34,73.91 U3.5V1 ; 54.16,85.79 47.24,92.71 34.67,92.71 29.46,87.5 25.93,87.5 ; U3.5V2 40.01,23.11 v3(38.73,21.84) ; U5.2 U5.1 33.88,39.68 C3.2 v3(29.77,34.29)
  Bottom Layer w0.508: v3(29.77,34.29) 22.73,27.26 v3(22.73,22.73) ; U5.2 41.15,45.11 41.15,76.33 44.96,80.14 49.91,80.14 53.47,83.69 USART2.1
  Bottom Layer w0.914: v3(29.77,34.29) 33.66,34.29 36.45,31.5 36.45,24.13 v3(38.73,21.84) v3(38.73,16.13)
GND:
  vias: v1(5.08,86.36) v1(5.08,81.28) v1(5.08,76.2) v1(5.08,71.12) v1(5.08,55.88) v1(5.08,50.8) v1(5.08,45.72) v1(5.08,40.64) v1(5.08,35.56) v1(5.08,30.48) v1(5.08,25.4) v1(5.08,20.32) v1(5.08,10.16) v1(5.08,5.08) v1(10.16,91.44) v1(10.16,86.36) v1(10.16,81.28) v1(10.16,76.2) v1(10.16,71.12) v1(10.16,55.88) v1(10.16,45.72) v1(10.16,35.56) v1(10.16,30.48) v1(10.16,25.4) v1(10.16,20.32) v1(10.16,15.24) v1(10.16,10.16) v1(10.16,5.08) v1(15.24,91.44) v1(15.24,86.36) v1(15.24,81.28) v1(15.24,76.2) v1(15.24,71.12) v1(15.24,15.24) v1(15.24,10.16) v1(15.24,5.08) v1(20.32,91.44) v1(20.32,86.36) v1(20.32,81.28) v1(20.32,76.2) v1(20.32,66.04) v1(20.32,60.96) v1(20.32,55.88) v1(20.32,50.8) v1(20.32,45.72) v1(20.32,40.64) v1(20.32,35.56) v1(20.32,30.48) v1(20.32,25.4) v1(20.32,10.16) v1(20.32,5.08) v1(25.4,81.28) v1(25.4,60.96) v1(25.4,55.88) v1(25.4,50.8) v1(25.4,45.72) v1(25.4,35.56) v1(25.4,25.4) v1(25.4,10.16) v1(25.4,5.08) v1(30.48,91.44) v1(30.48,86.36) v1(30.48,76.2) v1(30.48,66.04) v1(30.48,60.96) v1(30.48,55.88) v1(30.48,50.8) v1(30.48,45.72) v1(30.48,40.64) v1(30.48,30.48) v1(30.48,20.32) v1(30.48,15.24) v1(30.48,10.16) v1(30.48,5.08) v1(35.56,91.44) v1(35.56,86.36) v1(35.56,81.28) v1(35.56,71.12) v1(35.56,60.96) v1(35.56,55.88) v1(35.56,50.8) v1(35.56,45.72) v1(35.56,35.56) v1(35.56,15.24) v1(35.56,10.16) v1(35.56,5.08) v1(40.64,91.44) v1(40.64,86.36) v1(40.64,81.28) v1(40.64,30.48) v1(40.64,25.4) v1(40.64,10.16) v1(40.64,5.08) v1(45.72,91.44) v1(45.72,86.36) v1(45.72,81.28) v1(45.72,76.2) v1(45.72,10.16) v1(45.72,5.08) v1(50.8,91.44) v1(50.8,86.36) v1(50.8,76.2) v1(50.8,25.4) v1(50.8,20.32) v1(50.8,15.24) v1(50.8,10.16) v1(50.8,5.08) v1(55.88,91.44) v1(55.88,81.28) v1(55.88,76.2) v1(55.88,71.12) v1(55.88,66.04) v1(55.88,60.96) v1(55.88,55.88) v1(55.88,50.8) v1(55.88,45.72) v1(55.88,40.64) v1(55.88,35.56) v1(55.88,30.48) v1(55.88,25.4) v1(55.88,20.32) v1(55.88,15.24) v1(60.96,91.44) v1(60.96,81.28) v1(60.96,76.2) v1(60.96,71.12) v1(60.96,66.04) v1(60.96,60.96) v1(60.96,55.88) v1(60.96,50.8) v1(60.96,45.72) v1(60.96,40.64) v1(60.96,35.56) v1(60.96,30.48) v1(60.96,25.4) v1(60.96,20.32) v1(60.96,10.16) v1(66.04,91.44) v1(66.04,81.28) v1(66.04,76.2) v1(66.04,66.04) v1(66.04,60.96) v1(66.04,55.88) v1(66.04,50.8) v1(66.04,45.72) v1(66.04,40.64) v1(66.04,35.56) v1(66.04,30.48) v1(66.04,25.4) v1(66.04,15.24) v1(66.04,5.08) v1(71.12,91.44) v1(71.12,81.28) v1(71.12,76.2) v1(71.12,71.12) v1(71.12,60.96) v1(71.12,55.88) v1(71.12,50.8) v1(71.12,45.72) v1(71.12,40.64) v1(71.12,35.56) v1(71.12,5.08) v1(76.2,91.44) v1(76.2,86.36) v1(76.2,81.28) v1(76.2,76.2) v1(76.2,71.12) v1(76.2,66.04) v1(76.2,55.88) v1(76.2,50.8) v1(76.2,45.72) v1(76.2,40.64) v1(76.2,25.4) v1(76.2,20.32) v1(76.2,15.24) v1(76.2,5.08) v1(81.28,91.44) v1(81.28,86.36) v1(81.28,81.28) v1(81.28,15.24) v1(81.28,5.08) v1(86.36,91.44) v1(86.36,86.36) v1(86.36,71.12) v1(86.36,66.04) v1(86.36,60.96) v1(86.36,55.88) v1(86.36,50.8) v1(86.36,45.72) v1(86.36,40.64) v1(86.36,35.56) v1(86.36,30.48) v1(86.36,25.4) v1(86.36,20.32) v1(86.36,15.24) v1(86.36,5.08) v1(91.44,91.44) v1(91.44,86.36) v1(91.44,81.28) v1(91.44,76.2) v1(91.44,71.12) v1(91.44,66.04) v1(91.44,60.96) v1(91.44,55.88) v1(91.44,50.8) v1(91.44,45.72) v1(91.44,40.64) v1(91.44,35.56) v1(91.44,30.48) v1(91.44,25.4) v1(91.44,20.32) v1(91.44,5.08)
VCC: length 97.8
  Top Layer w1.524: U9.3 15.62,66.67 19.43,70.48 30.47,70.48 33.88,67.07 U4.1 U4.2
  Top Layer w2.5: v2(16.11,34.8) U1.1 16.11,50.2 C6.1 15.76,60.81 U9.6 U9.3
  Bottom Layer w1.524: TurningFan.2 29.44,13.36 27.43,15.37 21.59,15.37 16.11,20.84 16.11,21.09
  Bottom Layer w2: 16.11,21.09 12.3,17.27 DriveFan.2
  Bottom Layer w2.5: v2(16.11,34.8) 16.11,21.09
I2C3_SCL: length 34.4
  Top Layer w0.254: U3.A8 71.5,32.89 U8.3
I2C3_SDA: length 33.3
  Top Layer w0.254: U3.C9 80.77,37.08 78.36,37.08 74.04,32.77 U8.4
PWM1: length 35.4
  Top Layer w0.254: U3.A7 41.78,45.97 39.88,44.07 39.88,37.34 35.31,32.77 20.13,32.77 R3.2
PWM2: length 19.9
  Top Layer w0.254: U3.A6 45.21,44.7 42.04,44.7 40.89,43.56 40.89,36.07 38.68,33.86 38.68,31.28 R7.2
SERVOCTRL: length 34
  Bottom Layer w0.254: U3.D12 76.96,30.73 62.23,16 62.23,9.65 H1.1
SERVOCTRL2: length 38.1
  Bottom Layer w0.254: U3.D13 81.79,30.73 80.52,29.46 78.11,29.46 63.63,14.99 63.63,8.13 H2.1
SERVOCTRL3: length 33.7
  Bottom Layer w0.254: H3.1 60.83,11.18 60.83,17.27 76.83,33.27 U3.D14
UART4_RX: length 39.6
  Top Layer w0.381: U3.A1 41.15,53.59 39.5,55.25 39.5,69.47 31.24,77.72 31.24,80.01 28.83,82.42 25.93,82.42
UART4_TX: length 43.4
  Top Layer w0.381: U3.A0 45.21,54.86 41.78,54.86 40.77,55.88 40.77,70.1 32.64,78.23 32.64,80.77 28.45,84.96 P1.3
UART5_RX: length 13.5
  Top Layer w0.254: U3.B12 81.15,18.92 83.69,18.92 85.34,20.57 85.34,23.11 H4.3
UART5_TX: length 10.2
  Top Layer w0.254: H4.4 83.95,24.26 83.95,22.48 U3.B13
USART1_RX: length 20.3
  Bottom Layer w0.254: USART1.4 80.52,83.69 84.45,79.76 84.45,68.71 U3.B7
USART1_TX: length 18.1
  Bottom Layer w0.254: USART1.3 77.7,68.09 U3.B6
USART2_RX: length 35.2
  Top Layer w0.254: USART2.4 61.66,76.13 77.85,59.94 80.77,59.94 U3.D6
USART2_TX: length 35.1
  Top Layer w0.254: USART2.3 59.16,76.22 76.58,58.8 79.38,58.8 U3.D5
USART3_RX: length 15.5
  Bottom Layer w0.254: U3.B11 42.55,25.65 40.39,23.5 40.39,12.77 USART3.4
USART3_TX: length 17.2
  Bottom Layer w0.254: U3.B10 45.21,24.38 42.55,24.38 41.53,23.37 41.53,15.62 42.67,14.48 42.67,12.59 USART3.3
$1N689: length 7.8
  Top Layer w0.381: R3.1 18.57,29.7 18.57,27.34 17.14,25.92 R4.1 15.93,25.72 Q1.2
$1N701: length 7.7
  Top Layer w0.381: R1.1 8.79,24.35 Q2.2 9.21,25.72 10.16,26.67 11.37,26.67
$1N976: length 7
  Top Layer w0.381: R5.1 31.25,21.96 29.44,23.77 Q4.2 29.78,24.45 30.61,25.27 32.02,25.27 Q3.3
$1N993: length 17.6
  Top Layer w0.508: 6.29,26.67 R2.1 4.7,21.96 3.68,20.95 3.68,16.19 DriveFan.4
$1N1002: length 14.9
  Top Layer w0.508: TurningFan.3 26.92,12.59 26.92,14.86 28.58,16.51 28.58,21.21 27.82,21.96 R6.1 26.94,22.11 Q4.3
$1N1022: length 9
  Top Layer w0.254: Q3.2 37.01,24.45 R8.1 37.22,24.64 38.23,24.64 38.73,25.15 R7.1
$1N3852: length 2.7
  Top Layer w0.508: R9.1 86.36,78.71 86.35,78.7
$1N4179: length 3.1
  Top Layer w0.381: R10.1 47.8,84.62 LED2.1
$1N8727: length 20.3
  Top Layer w2.5: CN1.2 17.57,75.99 10.92,69.34 U9.2 U9.5

## Copper pours and planes (outline as drawn; the poured copper is in the pictures)
GND on Top Layer: 0,95.25 92.46,95.25 92.46,0 0,0
GND on Bottom Layer: 0,95.25 92.46,95.25 92.46,0 0,0

Small or netless copper shapes (teardrops, artwork), in the pictures only: 104 on Top Layer, 23 on Bottom Layer

## Text on the board
Bottom Silkscreen Layer: 2023_10 / Turtle
Top Silkscreen Layer: pwm | 12V | GND | 3.3V | SCL | SDA | 5V | UART5 | IMU_901 | tx | rx | 3V3 | OUT | IN | 12V Battery | 2023_10 / Turtle
